# Altium schematic sheet Sensor_PI_Hat.SchDoc
size 279 x 215 mm; SheetNumber: 1; SheetTotal: 3; ENG_APP_DATE: --/--/--; DSN_APP_DATE: --/--/--; CHK_APP_DATE: --/--/--
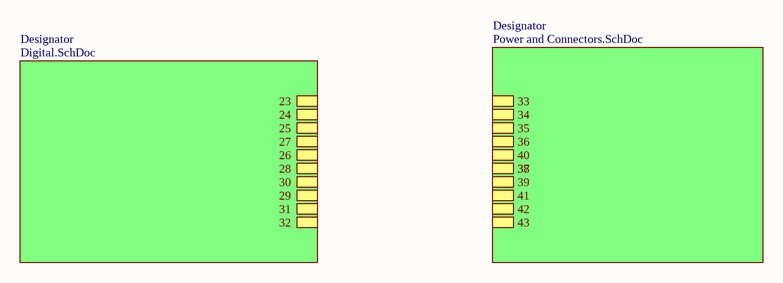
[diagram p0: Sensor_PI_Hat.SchDoc]

## Sub-sheets
Designator = Digital.SchDoc: 23, 24, 25, 26, 27, 28, 29, 30, 31, 32
Designator = Power and Connectors.SchDoc: 33, 34, 35, 36, 37, 38, 39, 40, 41, 42, 43

## Nets
(unnamed): sheet Designator/37, sheet Designator/38

## Notes on the sheet
- Title
- Author
- Date
- Texas A&M Sounding Rocketry Team
- Revision